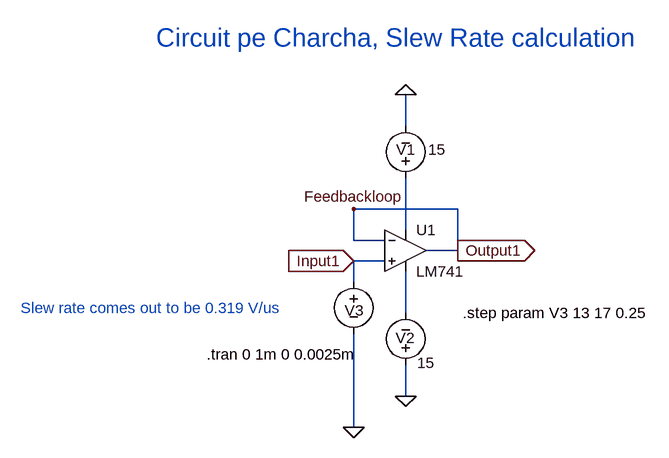
[diagram p0: schematic OpAmpSlewRateCalculation.asc]
OpAmpSlewRateCalculation.asc, the LTspice schematic file:
Version 4
SHEET 1 1692 680
WIRE 224 -96 224 -144
WIRE 304 32 144 32
WIRE 224 64 224 -16
WIRE 144 80 144 32
WIRE 192 80 144 80
WIRE 304 96 304 32
WIRE 304 96 256 96
WIRE 192 112 144 112
WIRE 144 144 144 112
WIRE 224 192 224 128
WIRE 224 320 224 272
WIRE 144 368 144 224
FLAG 144 368 0
FLAG 224 -144 0
FLAG 224 320 0
FLAG 304 96 Output1
IOPIN 304 96 Out
FLAG 144 112 Input1
IOPIN 144 112 In
FLAG 144 32 Feedbackloop
SYMBOL OpAmps\\LM741 224 32 R0
SYMATTR InstName U1
SYMBOL voltage 224 0 R180
WINDOW 0 -15 60 Left 2
WINDOW 3 -62 60 Left 2
WINDOW 123 0 0 Left 0
WINDOW 39 0 0 Left 0
SYMATTR InstName V1
SYMATTR Value 15
SYMBOL voltage 224 288 R180
WINDOW 0 -14 58 Left 2
WINDOW 3 -45 19 Left 2
WINDOW 123 0 0 Left 0
WINDOW 39 0 0 Left 0
SYMATTR InstName V2
SYMATTR Value 15
SYMBOL voltage 144 128 R0
WINDOW 0 -14 60 Left 2
WINDOW 3 -228 79 Invisible 2
WINDOW 123 0 0 Left 0
WINDOW 39 0 0 Left 0
SYMATTR InstName V3
SYMATTR Value PULSE(0 {V3} 0 0 0 1 1 1)
TEXT -160 -232 Left 4 ;Circuit pe Charcha, Slew Rate calculation
TEXT -368 184 Left 2 ;Slew rate comes out to be 0.319 V/us
TEXT -82 256 Left 2 !.tran 0 1m 0 0.0025m
TEXT 312 192 Left 2 !.step param V3 13 17 0.25

The netlist it stands for:
* OpAmpSlewRateCalculation.asc
XU1 Input1 Feedbackloop N001 N002 Feedbackloop LM741  ; pins In+ In- V+ V- OUT
V1 N001 0 15
V2 0 N002 15
V3 Input1 0 PULSE(0 {V3} 0 0 0 1 1 1)
* Circuit pe Charcha, Slew Rate calculation
* Slew rate comes out to be 0.319 V/us
.tran 0 1m 0 0.0025m
.step param V3 13 17 0.25
.lib LM741.lib
.backanno
.end